# EAGLE schematic mixer-preamp (EAGLE 7.3.0)
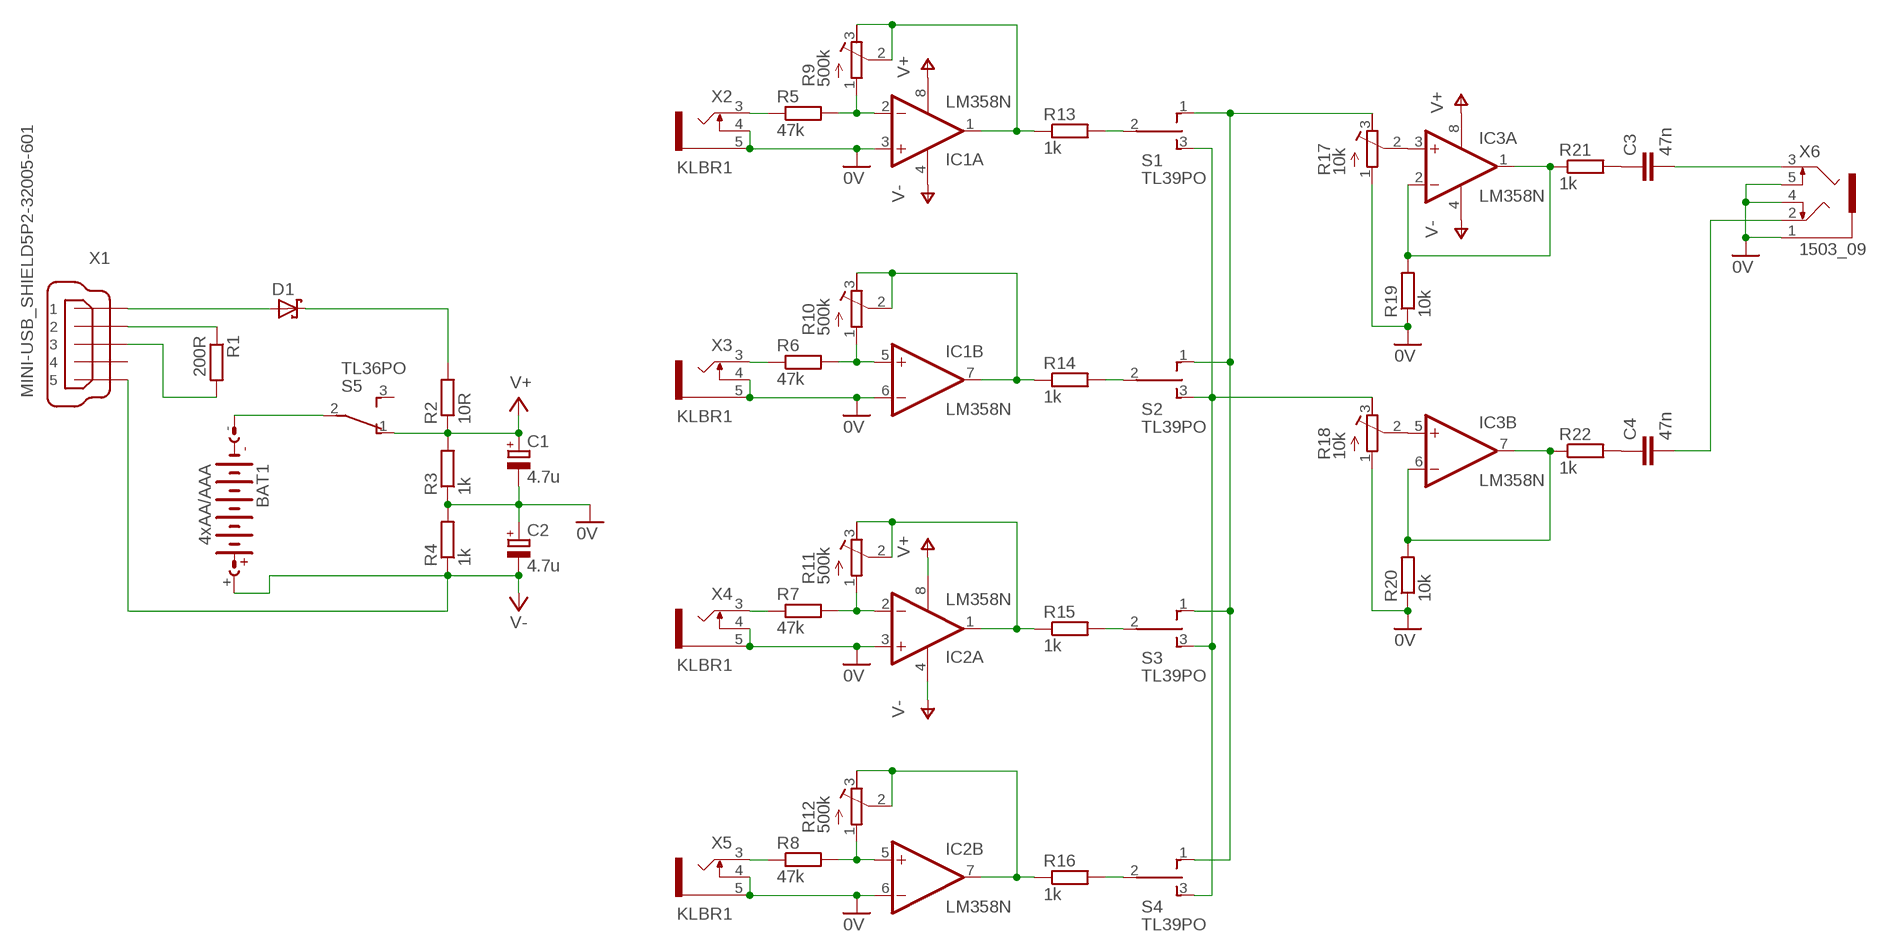
[diagram p0: schematic, sheet 1]

## Parts
BAT1  4xAA/AAA  AB9V  [AB9V]
C1  4.7u  CPOL-EUE5-5  [E5-5]
C2  4.7u  CPOL-EUE5-5  [E5-5]
C3  47n  C-EU025-024X044  [C025-024X044]
C4  47n  C-EU025-024X044  [C025-024X044]
D1  SCHOTTKY-DIODEDO35-7  [DO35-7]
IC1  LM358N  [DIL08]
IC2  LM358N  [DIL08]
IC3  LM358N  [DIL08]
R1  200R  R-EU_0204/2V  [0204V]
R2  10R  R-EU_0204/7  [0204/7]
R3  1k  R-EU_0204/2V  [0204V]
R4  1k  R-EU_0204/2V  [0204V]
R5  47k  R-EU_0207/10  [0207/10]
R6  47k  R-EU_0207/10  [0207/10]
R7  47k  R-EU_0207/10  [0207/10]
R8  47k  R-EU_0207/10  [0207/10]
R9  500k  R-TRIMM3296W  [RTRIM3296W]
R10  500k  R-TRIMM3296W  [RTRIM3296W]
R11  500k  R-TRIMM3296W  [RTRIM3296W]
R12  500k  R-TRIMM3296W  [RTRIM3296W]
R13  1k  R-EU_0207/10  [0207/10]
R14  1k  R-EU_0207/10  [0207/10]
R15  1k  R-EU_0207/10  [0207/10]
R16  1k  R-EU_0207/10  [0207/10]
R17  10k  R-TRIMM3296W  [RTRIM3296W]
R18  10k  R-TRIMM3296W  [RTRIM3296W]
R19  10k  R-EU_0207/10  [0207/10]
R20  10k  R-EU_0207/10  [0207/10]
R21  1k  R-EU_0207/10  [0207/10]
R22  1k  R-EU_0207/10  [0207/10]
S1  TL39PO  [TL3XPO]
S2  TL39PO  [TL3XPO]
S3  TL39PO  [TL3XPO]
S4  TL39PO  [TL3XPO]
S5  TL36PO  [TL3XPO]
X1  MINI-USB_SHIELD5P2-32005-601  [32005-601]
X2  KLBR1  [KLBR1]
X3  KLBR1  [KLBR1]
X4  KLBR1  [KLBR1]
X5  KLBR1  [KLBR1]
X6  1503_09  [1503_09]

## Nets
0V: C1.- C2.+ IC1.3(A:+IN) IC1.6(B:-IN) IC2.3(A:+IN) IC2.6(B:-IN) R3.1 R4.2 R17.1(A) R18.1(A) R19.1 R20.1 X2.4 X2.5 X3.4 X3.5 X4.4 X4.5 X5.4 X5.5 X6.1 X6.4 X6.5
N$1: R13.2 S1.2(P)
N$2: IC3.5(B:+IN) R18.2(S)
N$3: IC1.2(A:-IN) R5.2 R9.1(A)
N$4: R5.1 X2.3
N$5: IC3.6(B:-IN) IC3.7(B:OUT) R20.2 R22.1
N$6: IC1.1(A:OUT) R9.2(S) R9.3(E) R13.1
N$7: R14.2 S2.2(P)
N$8: IC1.5(B:+IN) R6.2 R10.1(A)
N$9: IC3.3(A:+IN) R17.2(S)
N$10: C4.2 X6.2
N$11: R6.1 X3.3
N$12: C3.1 R21.2
N$13: IC1.7(B:OUT) R10.2(S) R10.3(E) R14.1
N$14: C4.1 R22.2
N$15: R15.2 S3.2(P)
N$16: IC2.2(A:-IN) R7.2 R11.1(A)
N$17: C3.2 X6.3
N$18: D1.C R2.2
N$19: R7.1 X4.3
N$20: IC2.1(A:OUT) R11.2(S) R11.3(E) R15.1
N$21: IC3.1(A:OUT) IC3.2(A:-IN) R19.2 R21.1
N$22: R1.1 X1.2
N$23: R16.2 S4.2(P)
N$24: R1.2 X1.3
N$25: IC2.5(B:+IN) R8.2 R12.1(A)
N$26: R8.1 X5.3
N$27: IC2.7(B:OUT) R12.2(S) R12.3(E) R16.1
N$28: R18.3(E) S1.3(S) S2.3(S) S3.3(S) S4.3(S)
N$29: R17.3(E) S1.1(O) S2.1(O) S3.1(O) S4.1(O)
N$30: D1.A X1.1
N$31: BAT1.- S5.2(P)
V+: C1.+ IC1.8(P:V+) IC2.8(P:V+) IC3.8(P:V+) R2.1 R3.2 S5.1(O)
V-: BAT1.+ C2.- IC1.4(P:V-) IC2.4(P:V-) IC3.4(P:V-) R4.1 X1.5
Unconnected: S5.3(S) X1.4 X1.M1(S1) X1.M2(S2)

## Library data of the parts
BAT1 = battery:AB9V: 9-V BATTERY CLIP
C1 C2 = rcl:CPOL-EU: POLARIZED CAPACITOR, European symbol
C3 C4 = resistor:C-EU: CAPACITOR, European symbol
D1 = diode:SCHOTTKY-DIODE: Schottky Diode
IC1-IC3 = linear:LM358: OP AMP also LM158; LM258; LM2904 Source: http://cache.national.com/ds/LM/LM158.pdf
R1-R8 R13-R16 R19-R22 = resistor:R-EU_: RESISTOR, European symbol
R9-R12 R17 R18 = resistor:R-TRIMM: Trimm resistor
S1-S4 = switch:TL39PO: TINY SWITCH ON OFF ON Source: http://www2.produktinfo.conrad.com/datenblaetter/700000-724999/705152-da-01-de-Subminiaturschalter_TL_36YO.pdf
S5 = switch:TL36PO: TINY SWITCH ON - ON Source: http://www2.produktinfo.conrad.com/datenblaetter/700000-724999/705152-da-01-de-Subminiaturschalter_TL_36YO.pdf
X1 = con-cypressindustries:MINI-USB_SHIELD5P2-: MINI USB-B R/A DIP 5pol. Source: www.cypressindustries.com; OC_FARNELL: unknown; OC_NEWARK: unknown
X2-X5 = con-lumberg:KLBR?: Jack connectors according to JISC 6560, 2.5mm / 3.5 mm Klinkensteckverbinder nach JISC 6560, 2.5mm / 3,5 mm Source: http://www.lumberg.com/Produkte/PDFs/KLBR2.pdf www.lumberg.com/Produkte/PDFs/KLBR1.pdf; MPN: KLBR 1; OC_FARNELL: 1200140; OC_NEWARK: 97K2707
X6 = con-lumberg:1503_09: Jack connectors according to JISC 6560, 3.5 mm Klinkeneinbaukupplung nach JISC 6560, 3,5 mm, 3-polig/ stereo, abgewinkelte Ausführung, mit 2 Öffnern und Lötaugen, für Leiterplatten Rückseitenmontage Source: http://www.lumberg.com/Produkte/PDFs/1503_09.pdf; OC_FARNELL: 1243244; OC_NEWARK: unknown